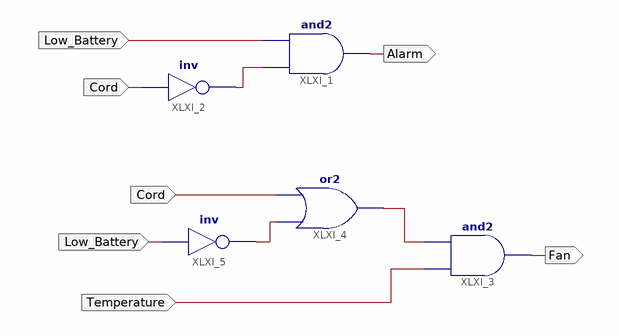
[diagram p0: schematic sheet 1]
// Xilinx ISE schematic Alarm_Fan.sch (spartan3e) as structural Verilog: 5 symbols, 5 ports
module Alarm_Fan (
  input  Low_Battery,
  input  Cord,
  input  Temperature,
  output Alarm,
  output Fan
);

  wire XLXN_1, XLXN_5, XLXN_6;

  not XLXI_2 (XLXN_1, Cord);
  and XLXI_1 (Alarm, XLXN_1, Low_Battery);
  and XLXI_3 (Fan, Temperature, XLXN_6);
  not XLXI_5 (XLXN_5, Low_Battery);
  or XLXI_4 (XLXN_6, XLXN_5, Cord);
endmodule
